# EAGLE design 555funcgen (EAGLE 5.11)
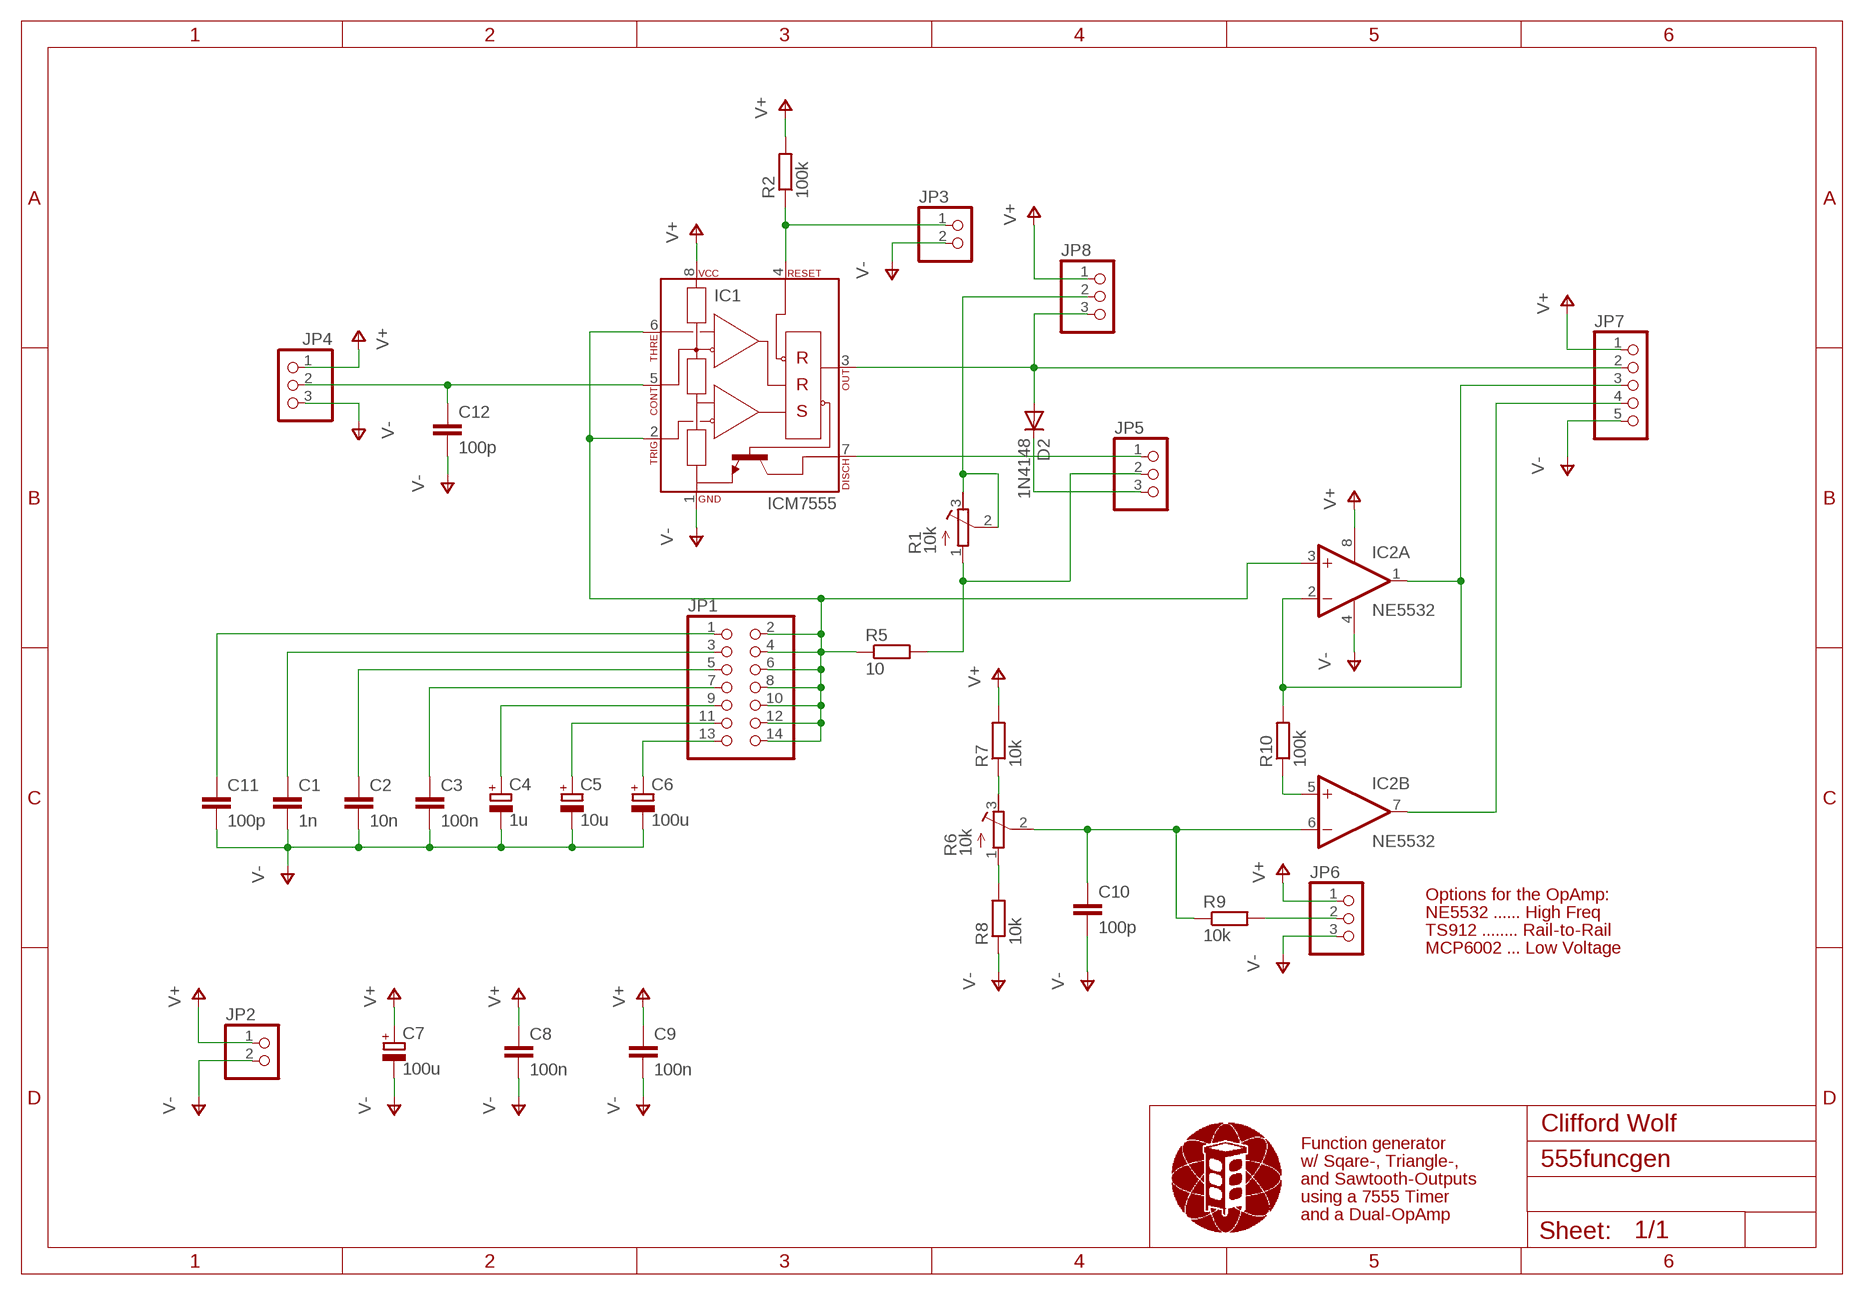
[diagram p0: schematic, sheet 1]

## Parts
C1  1n  C050-030X075  [C050-030X075]
C2  10n  C050-030X075  [C050-030X075]
C3  100n  C050-030X075  [C050-030X075]
C4  1u  CPOLE2-5  [E2-5]
C5  10u  CPOLE2-5  [E2-5]
C6  100u  CPOLE5-10.5  [E5-10,5]
C7  100u  CPOLE5-10.5  [E5-10,5]
C8  100n  C050-030X075  [C050-030X075]
C9  100n  C050-030X075  [C050-030X075]
C10  100p  C050-030X075  [C050-030X075]
C11  100p  C050-030X075  [C050-030X075]
C12  100p  C050-030X075  [C050-030X075]
D2  1N4148  [DO35-7]
IC1  ICM7555  [DIL08]
IC2  NE5532  [DIL08]
JP1  PINHD-2X7  [2X07]
JP2  PINHD-1X2  [1X02]
JP3  PINHD-1X2  [1X02]
JP4  PINHD-1X3  [1X03]
JP5  PINHD-1X3  [1X03]
JP6  PINHD-1X3  [1X03]
JP7  PINHD-1X5  [1X05]
JP8  PINHD-1X3  [1X03]
R1  10k  R-TRIMMRK09K113  [ALPS_RK09K113]
R2  100k  R0309/10  [0309/10]
R5  10  R0309/10  [0309/10]
R6  10k  R-TRIMMRK09K113  [ALPS_RK09K113]
R7  10k  R0309/10  [0309/10]
R8  10k  R0309/10  [0309/10]
R9  10k  R0309/10  [0309/10]
R10  100k  R0309/10  [0309/10]

## Nets
N$1: C1.1 JP1.3
N$2: C2.1 JP1.5
N$3: C3.1 JP1.7
N$4: C4.+ JP1.9
N$5: C5.+ JP1.11
N$6: C6.+ JP1.13
N$7: IC2.1(A:OUT) IC2.2(A:-IN) JP7.3 R10.2
N$8: IC2.5(B:+IN) R10.1
N$9: IC1.7(DISCH) JP5.1
N$10: D2.C JP5.3
N$11: IC1.4(RESET) JP3.1 R2.1
N$12: C12.1 IC1.5(CONT) JP4.2
N$13: JP5.2 R1.1(E) R5.2
N$14: IC1.2(TRIG) IC1.6(THRESH) IC2.3(A:+IN) JP1.2 JP1.4 JP1.6 JP1.8 JP1.10 JP1.12 JP1.14 R5.1
N$15: R6.3(A) R7.1
N$16: D2.A IC1.3(OUT) JP7.2 JP8.3
N$17: R6.1(E) R8.2
N$18: C10.1 IC2.6(B:-IN) R6.2(S) R9.1
N$19: JP6.2 R9.2
N$20: IC2.7(B:OUT) JP7.4
N$21: JP8.2 R1.2(S) R1.3(A)
N$22: C11.1 JP1.1
V+ [pwr]: C7.+ C8.1 C9.1 IC1.8(VCC) IC2.8(P:V+) JP2.1 JP4.1 JP6.1 JP7.1 JP8.1 R2.2 R7.2
V- [pwr]: C1.2 C2.2 C3.2 C4.- C5.- C6.- C7.- C8.2 C9.2 C10.2 C11.2 C12.2 IC1.1(GND) IC2.4(P:V-) JP2.2 JP3.2 JP4.3 JP6.3 JP7.5 R8.1

## Notes on the sheet
- Options for the OpAmp:
- NE5532 ...... High Freq
- TS912 ........ Rail-to-Rail
- MCP6002 ... Low Voltage
- Clifford Wolf
- Function generator
- w/ Sqare-, Triangle-,
- and Sawtooth-Outputs
- using a 7555 Timer
- and a Dual-OpAmp

## Library data of the parts
C1-C3 C8-C12 = mp_passive:C: CAPACITOR, European symbol
C4-C7 = mp_passive:CPOL: POLARIZED CAPACITOR, European symbol
D2 = mp_diode:1N4148: Switching Diode
IC1 = mp_miscic:ICM7555: ICM7555 universal RC timer
IC2 = mp_miscic:NE5532: OP AMP NE5532
JP1 = mpc_pinhead:PINHD-2X7: PIN HEADER
JP2 JP3 = mpc_pinhead:PINHD-1X2: PIN HEADER
JP4-JP6 JP8 = mpc_pinhead:PINHD-1X3: PIN HEADER
JP7 = mpc_pinhead:PINHD-1X5: PIN HEADER
R1 R6 = mp_switch:R-TRIMM: Trimm resistor
R2 R5 R7-R10 = mp_passive:R: RESISTOR, European symbol

## Net classes
1 pwr: width 1.27 mm

## Board
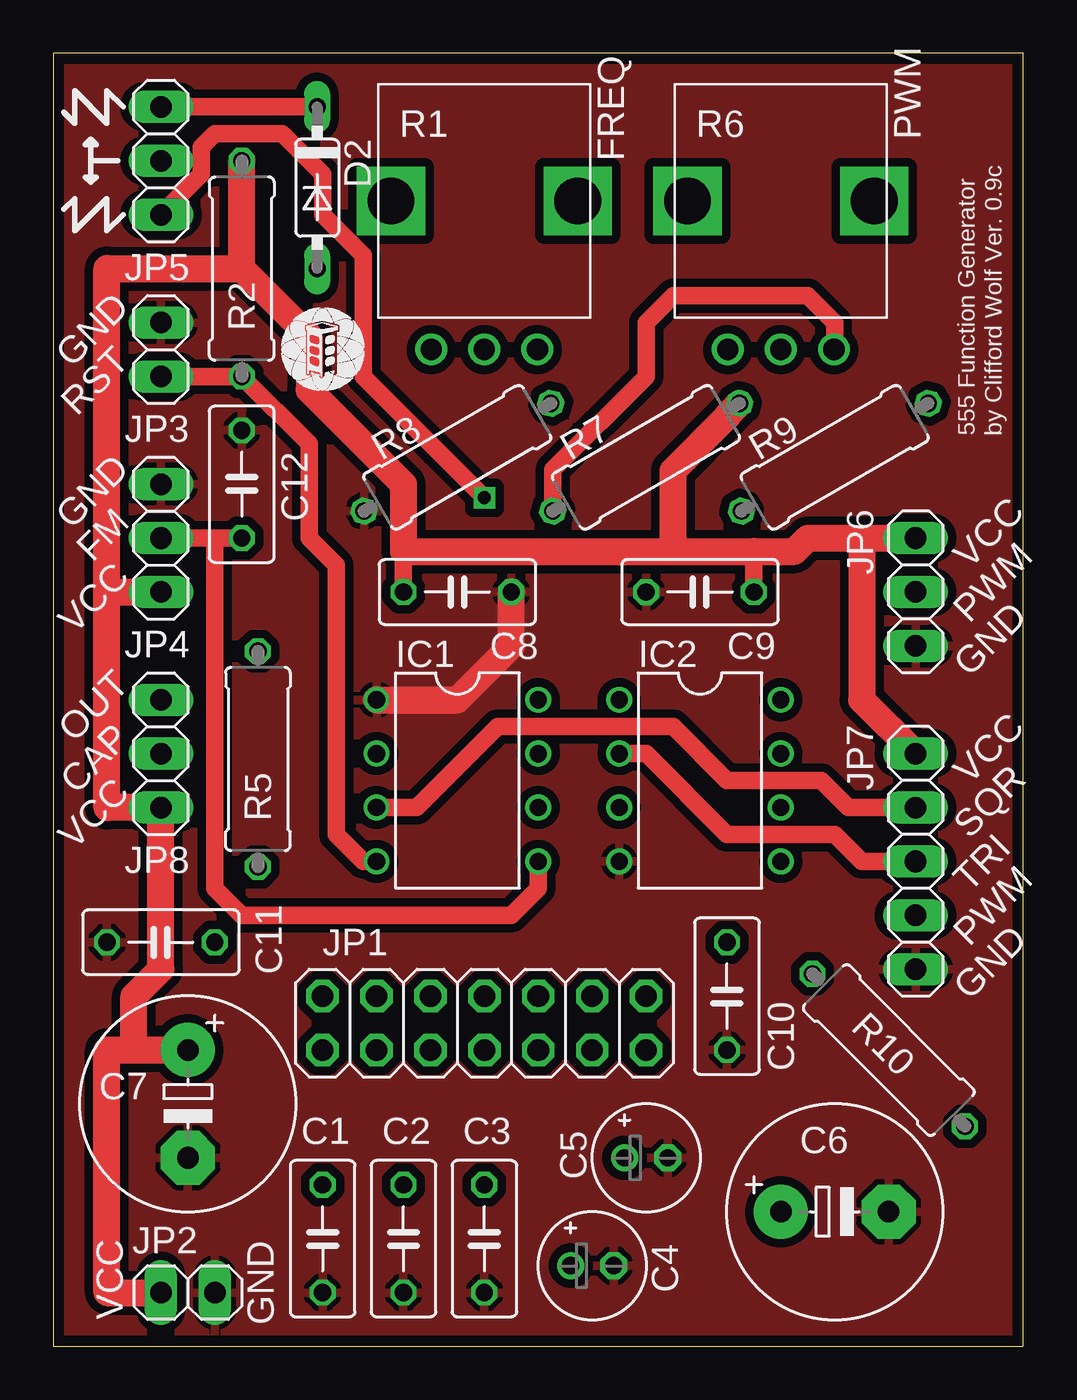
[diagram p1: board, top side]
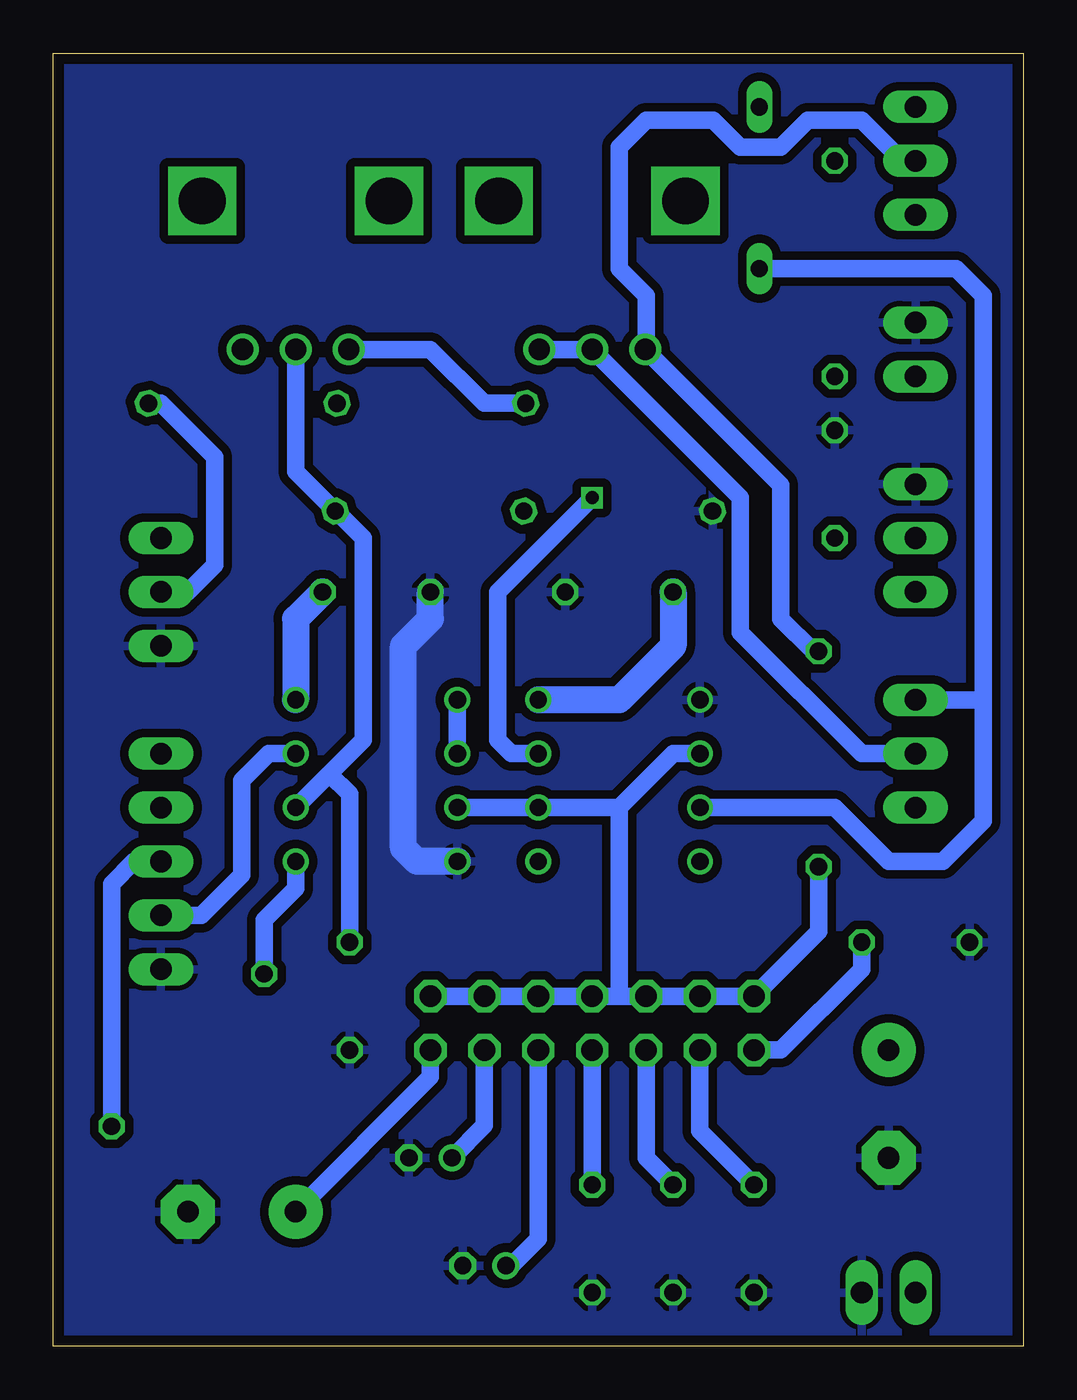
[diagram p2: board, bottom side, seen from below]

Size 45.72 x 60.96 mm. Coordinates in mm from the lower left corner, seen from the top.
Outline: 0,0 45.72,0 45.72,60.96 0,60.96 0,0
Copper layers (1*16): Top 0.035mm / dielectric 1.5mm / Bottom 0.035mm
Design rules "8mils": minimum track width 8mil, minimum drill 0.6mm, track to track 8mil, track to pad 8mil, pad to pad 8mil, via to via 8mil, smd to smd 0mil, copper to edge 20mil, drill to drill 10mil, minimum pad ring 8mil, minimum via ring 8mil, stop-mask expansion 0mil, vias tented up to drill 0mil, thermal gap 10mil

### Footprints (pad centres in the part's own frame; a part is rotated, then mirrored left to right if it is on the bottom)
C050-030X075 = drill 0.813 octagon: 1 -2.54,0; 2 2.54,0
E2-5 = drill 0.813 pad 1.27 round: + -1.016,0 | drill 0.813 pad 1.27 octagon: - 1.016,0
E5-10,5 = drill 1.016 pad 2.54 round: + -2.54,0 | drill 1.016 pad 2.54 octagon: - 2.54,0
DO35-7 = drill 0.813 long: A 3.81,0; C -3.81,0
DIL08 = drill 0.813 round: 1 -3.81,-3.81; 2 -1.27,-3.81; 3 1.27,-3.81; 4 3.81,-3.81; 5 3.81,3.81; 6 1.27,3.81; 7 -1.27,3.81; 8 -3.81,3.81
2X07 = drill 1.016 octagon: 1 -7.62,-1.27; 2 -7.62,1.27; 3 -5.08,-1.27; 4 -5.08,1.27; 5 -2.54,-1.27; 6 -2.54,1.27; 7 0,-1.27; 8 0,1.27; 9 2.54,-1.27; 10 2.54,1.27; 11 5.08,-1.27; 12 5.08,1.27; 13 7.62,-1.27; 14 7.62,1.27
1X02 = drill 1.016 long: 1 -1.27,0; 2 1.27,0
1X03 = drill 1.016 long: 1 -2.54,0; 2 0,0; 3 2.54,0
1X05 = drill 1.016 long: 1 -5.08,0; 2 -2.54,0; 3 0,0; 4 2.54,0; 5 5.08,0
ALPS_RK09K113 = drill 1 round: 1 -2.5,0; 2 0,0; 3 2.5,0 | drill 2.2 square: NC1 -4.4,7; NC2 4.4,7
0309/10 = drill 0.813 octagon: 1 -5.08,0; 2 5.08,0

### Placement (x,y rotation side)
C1  12.7,5.08 270 top
C2  16.51,5.08 270 top
C3  20.32,5.08 270 top
C4  25.4,3.81 0 top
C5  27.94,8.89 0 top
C6  36.83,6.35 0 top
C7  6.35,11.43 270 top
C8  19.05,35.56 0 top
C9  30.48,35.56 180 top
C10  31.75,16.51 270 top
C11  5.08,19.05 180 top
C12  8.89,40.64 90 top
D2  12.45,54.61 270 top
IC1  19.05,26.67 270 top
IC2  30.48,26.67 270 top
JP1  20.32,15.24 0 top
JP2  6.35,2.54 0 top
JP3  5.08,46.99 90 top
JP4  5.08,38.1 90 top
JP5  5.08,55.88 90 top
JP6  40.64,35.56 270 top
JP7  40.64,22.86 270 top
JP8  5.08,27.94 90 top
R1  20.32,46.99 0 top
R2  8.89,50.8 90 top
R5  9.65,27.69 90 top
R6  34.29,46.99 0 top
R7  27.94,41.91 30 top
R8  19.05,41.91 30 top
R9  36.83,41.91 30 top
R10  39.37,13.97 315 top
U$2  [METALAB]  12.7,46.99 0 top

### Tracks (layer width: path | path; a pad name or v marks a point on that pad's centre or on a via)
N$1
  Bottom 0.813: C1.1 15.24,10.16 JP1.3
N$2
  Bottom 0.813: C2.1 17.78,8.89 JP1.5
N$3
  Bottom 0.813: C3.1 JP1.7
N$4
  Bottom 0.813: C4.+ 24.13,3.81 22.86,5.08 JP1.9
N$5
  Bottom 0.813: JP1.11 25.4,10.41 C5.+
N$6
  Bottom 0.813: JP1.13 27.94,12.7 C6.+
N$7
  Top 0.813: JP7.3 38.1,22.86 36.83,24.13 31.75,24.13 27.94,27.94 IC2.2
  Bottom 0.813: R10.2 42.96,21.81 41.91,22.86 JP7.3 | IC2.2 IC2.1
N$8
  Bottom 0.813: R10.1 35.78,20.1 34.29,21.59 IC2.5
N$9  (via drill 0.6)
  Top 0.813: v20.32,40.01 14.61,45.72 14.61,51.44 12.7,53.34 12.7,55.24 10.79,57.15 7.62,57.15 6.99,56.52 6.99,55.24 JP5.1
  Bottom 0.813: IC1.7 24.13,27.94 24.77,28.57 24.77,35.56 v20.32,40.01
N$10
  Top 0.813: JP5.3 D2.C
N$11
  Top 0.813: JP3.1 R2.1 12.06,42.55 12.06,38.1 13.34,36.83 13.34,24.13 14.61,22.86 IC1.4
N$12
  Top 0.813: 7.62,38.1 JP4.2 | 7.62,38.1 C12.1 | IC1.5 22.86,21.59 21.59,20.32 8.89,20.32 7.62,21.59 7.62,38.1
N$13
  Bottom 0.813: R5.2 9.91,32.77 11.43,34.29 11.43,40.6 R1.1 17.78,47.03 17.78,49.53 19.05,50.8 19.05,56.52 17.78,57.78 14.61,57.78 13.34,56.52 11.43,56.52 10.16,57.78 7.62,57.78 5.71,55.88 JP5.2
N$14
  Bottom 0.813: 19.05,16.51 JP1.6 JP1.4 JP1.2 9.65,19.56 R5.1 | 19.05,16.51 JP1.8 JP1.10 JP1.12 JP1.14 | IC1.2 16.51,27.94 19.05,25.4 | 19.05,16.51 19.05,25.4 | 19.05,25.4 IC1.6 IC2.3
N$15
  Top 0.813: R7.1 23.54,41.32 27.94,45.72 27.94,48.26 29.21,49.53 35.56,49.53 36.83,48.26 36.83,47.03 R6.3
N$16
  Top 0.813: JP7.2 37.47,25.4 36.2,26.67 31.75,26.67 29.21,29.21 20.95,29.21 17.14,25.4 IC1.3
  Bottom 0.813: D2.A 3.17,50.8 1.91,49.53 1.91,30.48 | IC1.3 8.89,25.4 6.35,22.86 3.81,22.86 1.91,24.77 1.91,30.48 | 1.91,30.48 JP8.3
N$17
  Bottom 0.813: R8.2 25.4,44.45 27.94,46.99 R6.1
N$18
  Bottom 0.813: R6.2 34.29,41.23 R9.1 32.38,39.37 31.11,38.1 31.11,28.57 32.7,26.99 | 32.7,26.99 IC2.6 | C10.1 31.75,26.04 32.7,26.99
N$19
  Bottom 0.813: R9.2 40.64,44.45 38.1,41.91 38.1,36.83 39.37,35.56 JP6.2
N$20
  Bottom 0.813: IC2.7 35.56,27.94 36.83,26.67 36.83,22.23 38.73,20.32 JP7.4
N$21
  Bottom 0.813: JP8.2 7.62,27.94 13.34,33.66 13.34,40.01 R1.2 R1.3
N$22
  Bottom 0.813: C11.1 7.62,17.78 11.43,13.97 JP1.1
V+
  Top 0.813: 16.51,37.47 C8.1 | 33.02,37.47 C9.1
  Top 1.27: JP2.1 2.54,2.54 2.54,13.97 3.81,13.97 | 3.81,13.97 C7.+ | 38.1,38.1 35.56,38.1 34.92,37.47 33.02,37.47 29.21,37.47 | 38.1,38.1 JP6.1 | JP7.1 38.1,30.48 38.1,38.1 | R7.2 31.75,43.81 29.21,41.27 29.21,37.47 | 29.21,37.47 16.51,37.47 16.51,40.64 12.06,45.09 12.06,47.62 8.89,50.8 | 8.89,50.8 R2.2 | 8.89,50.8 2.54,50.8 2.54,35.56 | 2.54,35.56 2.54,25.4 JP8.1 5.08,17.78 3.81,16.51 3.81,13.97 | 2.54,35.56 JP4.1
  Bottom 1.27: IC1.8 19.05,30.48 16.51,33.02 C8.1 | IC2.8 34.29,34.29 C9.1
V-
  Top 1.27: IC1.1 19.05,30.48 21.59,33.02 C8.2
  Bottom 1.27: C9.2 27.94,34.29 29.21,33.02 29.21,23.5 28.57,22.86 IC2.4
  pour Bottom (isolate 0.406): 0,60.96 45.72,60.96 45.72,0 0,0
  pour Top (isolate 0.406, rank 2): 0,60.96 45.72,60.96 45.72,0 0,0

### Text on the board
tPlace: PWM | FREQ | GND | RST | 555 Function Generator | by Clifford Wolf Ver. 0.9c | GND | FM | VCC | VCC | PWM | OUT | GND | CAP | VCC | VCC | SQR | TRI | PWM | GND | VCC | GND